# Altium schematic sheet parametrboard.SchDoc
size A; SheetNumber: 2; SheetTotal: 6
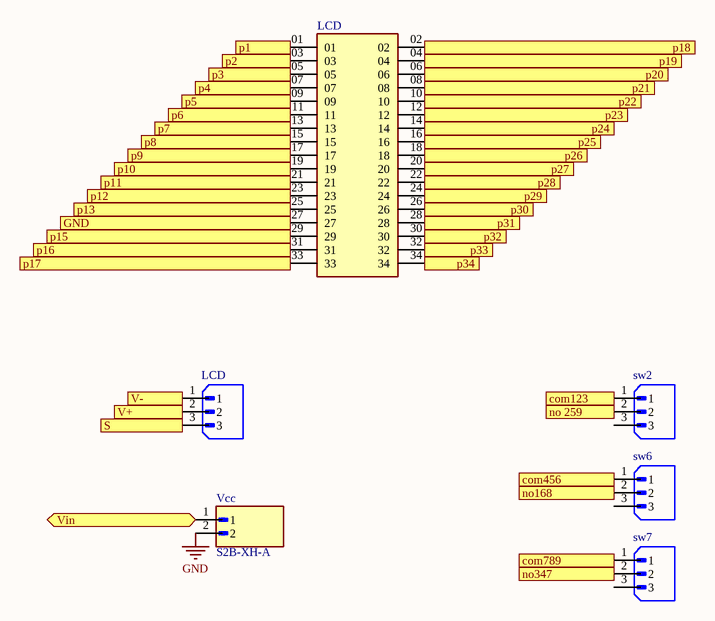
[diagram p0: parametrboard.SchDoc]

## Parts
(Parts that share a designator on the sheet are numbered #1, #2 ... from top to bottom, then left to right.)
LCD#1  TSW-117-23-G-D  [SAMTEC_TSW-117-23-G-D]  (value not drawn)
LCD#2  TSW-117-23-G-D  [SAMTEC_TSW-117-23-G-D]  (value not drawn)
sw2  B3B-XH-A  [JST_B3B-XH-A]  (value not drawn)
sw6  B3B-XH-A  [JST_B3B-XH-A]  (value not drawn)
sw7  B3B-XH-A  [JST_B3B-XH-A]  (value not drawn)
Vcc  S2B-XH-A  [JST_S2B-XH-A]

## Ports
com123 (out, see finetunebox[1A], BordBox[2C]), com456 (out, see finetunebox[1A], BordBox[3C]), com789 (out, see finetunebox[1A], BordBox[4C]), GND (out, see finetunebox[1B], BordBox[1B], BordBox[4B], Ctrl[4A]), no168 (out, see finetunebox[1A], BordBox[3C]), no347 (out, see finetunebox[1A], BordBox[4C]), no 259 (out, see finetunebox[1A], BordBox[2C]), p1 (out, see finetunebox[1A], BordBox[1A]), p2 (out, see finetunebox[1A], BordBox[1A]), p3 (out, see finetunebox[1A], BordBox[1A]), p4 (out, see finetunebox[1A], BordBox[1A]), p5 (out, see finetunebox[1A], BordBox[1A]), p6 (out, see finetunebox[1A], BordBox[1A]), p7 (out, see finetunebox[1A], BordBox[1A]), p8 (out, see finetunebox[1B], BordBox[1A]), p9 (out, see finetunebox[1B], BordBox[1A]), p10 (out, see finetunebox[1B], BordBox[1A]), p11 (out, see finetunebox[1B], BordBox[1B]), p12 (out, see finetunebox[1B], BordBox[1B]), p13 (out, see finetunebox[1B], BordBox[1B]), p15 (out, see finetunebox[1B], BordBox[1B]), p16 (out, see finetunebox[1B], BordBox[1B]), p17 (out, see finetunebox[1B], BordBox[1B]), p18 (out, see finetunebox[1B], BordBox[2A]), p19 (out, see finetunebox[1B], BordBox[2A]), p20 (out, see finetunebox[1B], BordBox[2A]), p21 (out, see finetunebox[1B], BordBox[2A]), p22 (out, see finetunebox[1B], BordBox[2A]), p23 (out, see finetunebox[1B], BordBox[2A]), p24 (out, see finetunebox[1B], BordBox[2A]), p25 (out, see finetunebox[1B], BordBox[2A]), p26 (out, see finetunebox[1B], BordBox[2A]), p27 (out, see finetunebox[1C], BordBox[2A]), p28 (out, see finetunebox[1C], BordBox[2B]), p29 (out, see finetunebox[1C], BordBox[2B]), p30 (out, see finetunebox[1C], BordBox[2B]), p31 (out, see finetunebox[1C], BordBox[2B]), p32 (out, see finetunebox[1C], BordBox[2B]), p33 (out, see finetunebox[1C], BordBox[2B]), p34 (out, see finetunebox[1C], BordBox[2B]), S (out, see finetunebox[1C], BordBox[2D]), V+ (out, see finetunebox[1C], BordBox[2D]), V- (out, see finetunebox[1C], BordBox[2D]), Vin (bidir, see finetunebox[1C])

## Nets
GND: Vcc.2
com123: sw2.1 ; port com123
com456: sw6.1 ; port com456
com789: sw7.1 ; port com789
GND: LCD#1.27 ; port GND  [a separate net that carries the same name]
no168: sw6.2 ; port no168
no347: sw7.2 ; port no347
no 259: sw2.2 ; port no 259
p1: LCD#1.01 ; port p1
p2: LCD#1.03 ; port p2
p3: LCD#1.05 ; port p3
p4: LCD#1.07 ; port p4
p5: LCD#1.09 ; port p5
p6: LCD#1.11 ; port p6
p7: LCD#1.13 ; port p7
p8: LCD#1.15 ; port p8
p9: LCD#1.17 ; port p9
p10: LCD#1.19 ; port p10
p11: LCD#1.21 ; port p11
p12: LCD#1.23 ; port p12
p13: LCD#1.25 ; port p13
p15: LCD#1.29 ; port p15
p16: LCD#1.31 ; port p16
p17: LCD#1.33 ; port p17
p18: LCD#1.02 ; port p18
p19: LCD#1.04 ; port p19
p20: LCD#1.06 ; port p20
p21: LCD#1.08 ; port p21
p22: LCD#1.10 ; port p22
p23: LCD#1.12 ; port p23
p24: LCD#1.14 ; port p24
p25: LCD#1.16 ; port p25
p26: LCD#1.18 ; port p26
p27: LCD#1.20 ; port p27
p28: LCD#1.22 ; port p28
p29: LCD#1.24 ; port p29
p30: LCD#1.26 ; port p30
p31: LCD#1.28 ; port p31
p32: LCD#1.30 ; port p32
p33: LCD#1.32 ; port p33
p34: LCD#1.34 ; port p34
S: LCD#2.3 ; port S
V+: LCD#2.2 ; port V+
V-: LCD#2.1 ; port V-
Vin: Vcc.1 ; port Vin

Not connected (* = marked no-connect by the designer): sw2 3; sw6 3; sw7 3

## Library data of the parts
LCD#2 sw2 sw6 sw7 = B3B-XH-A: Connector Header Through Hole 3 position 0.098 (2.50mm); MF: JST Sales; SnapEDA_Link: https://www.snapeda.com/parts/B3B-XH-A/JST+Sales+America+Inc./view-part/?ref=snap; Package: None; Value: *; MP: B3B-XH-A; Check_prices: https://www.snapeda.com/parts/B3B-XH-A/JST+Sales+America+Inc./view-part/?ref=eda
LCD#1 = TSW-117-23-G-D: Package: None; Price: None; Value: *; MP: TSW-117-23-G-D; Availability: Unavailable
Vcc = S2B-XH-A: Package: None; Price: None; Value: *; MP: S2B-XH-A; Availability: Unavailable